# EAGLE schematic dac2_v2 (EAGLE 5.12)
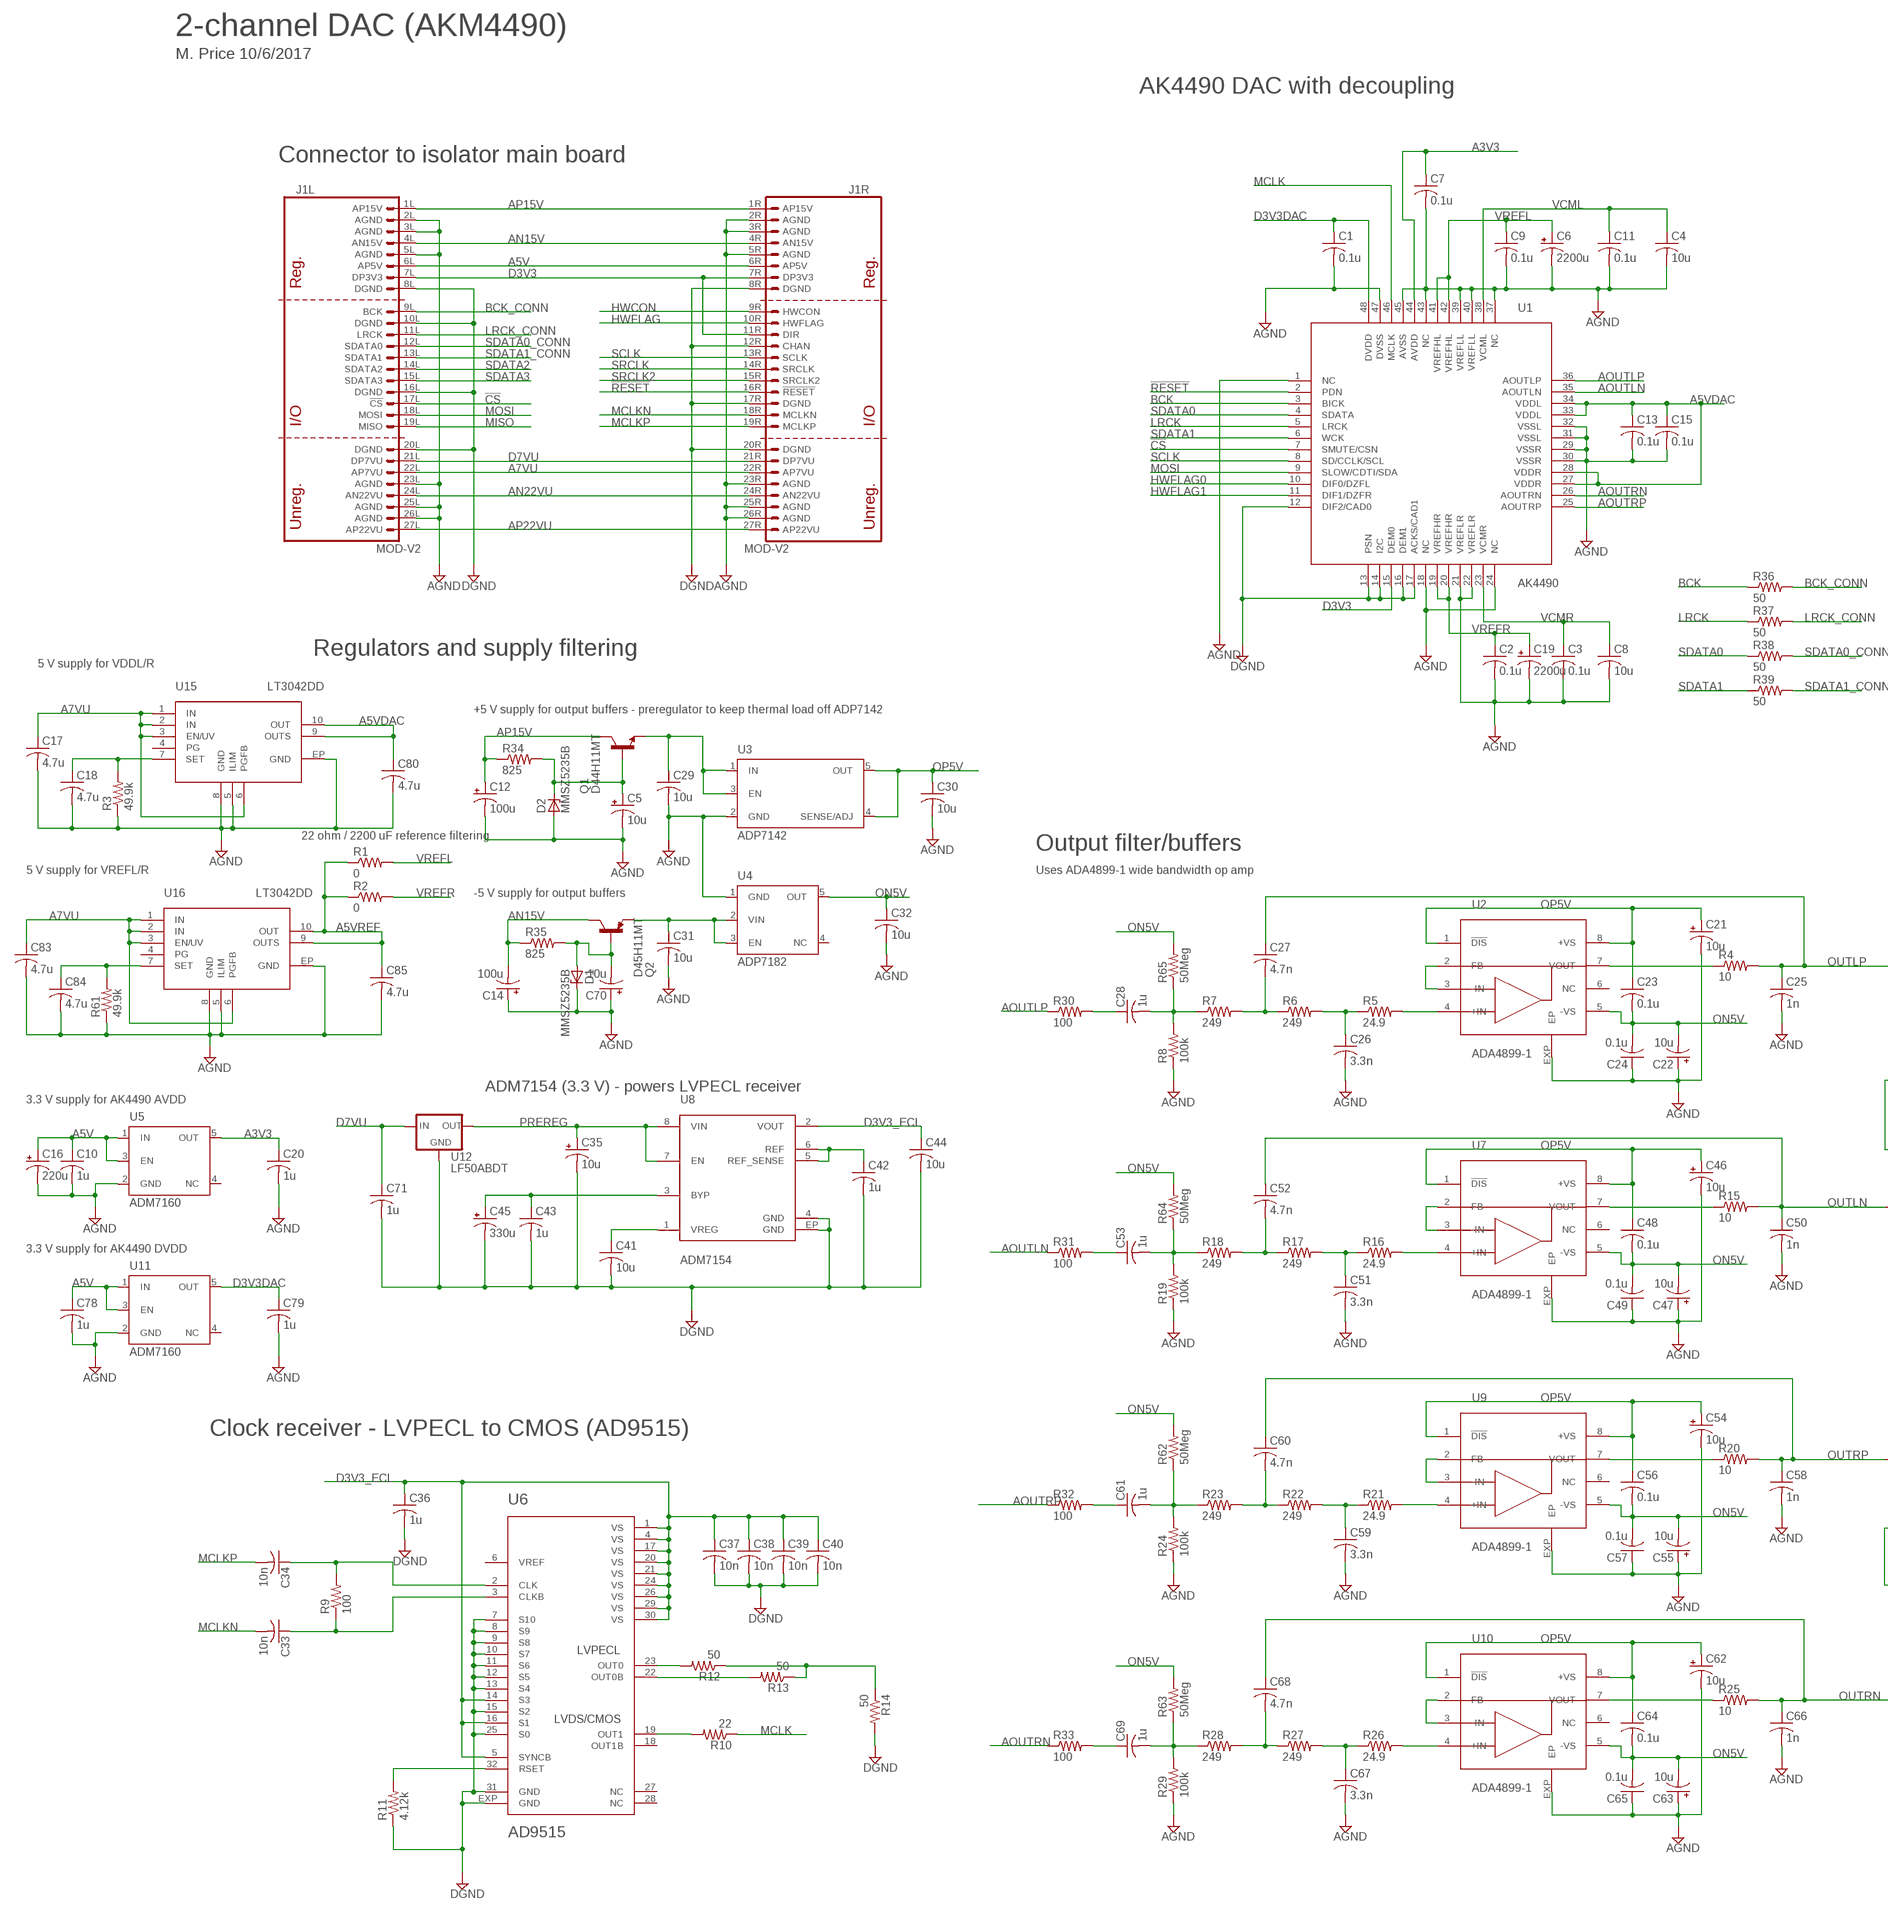
[diagram p0: schematic, sheet 1, part 1 of 2]
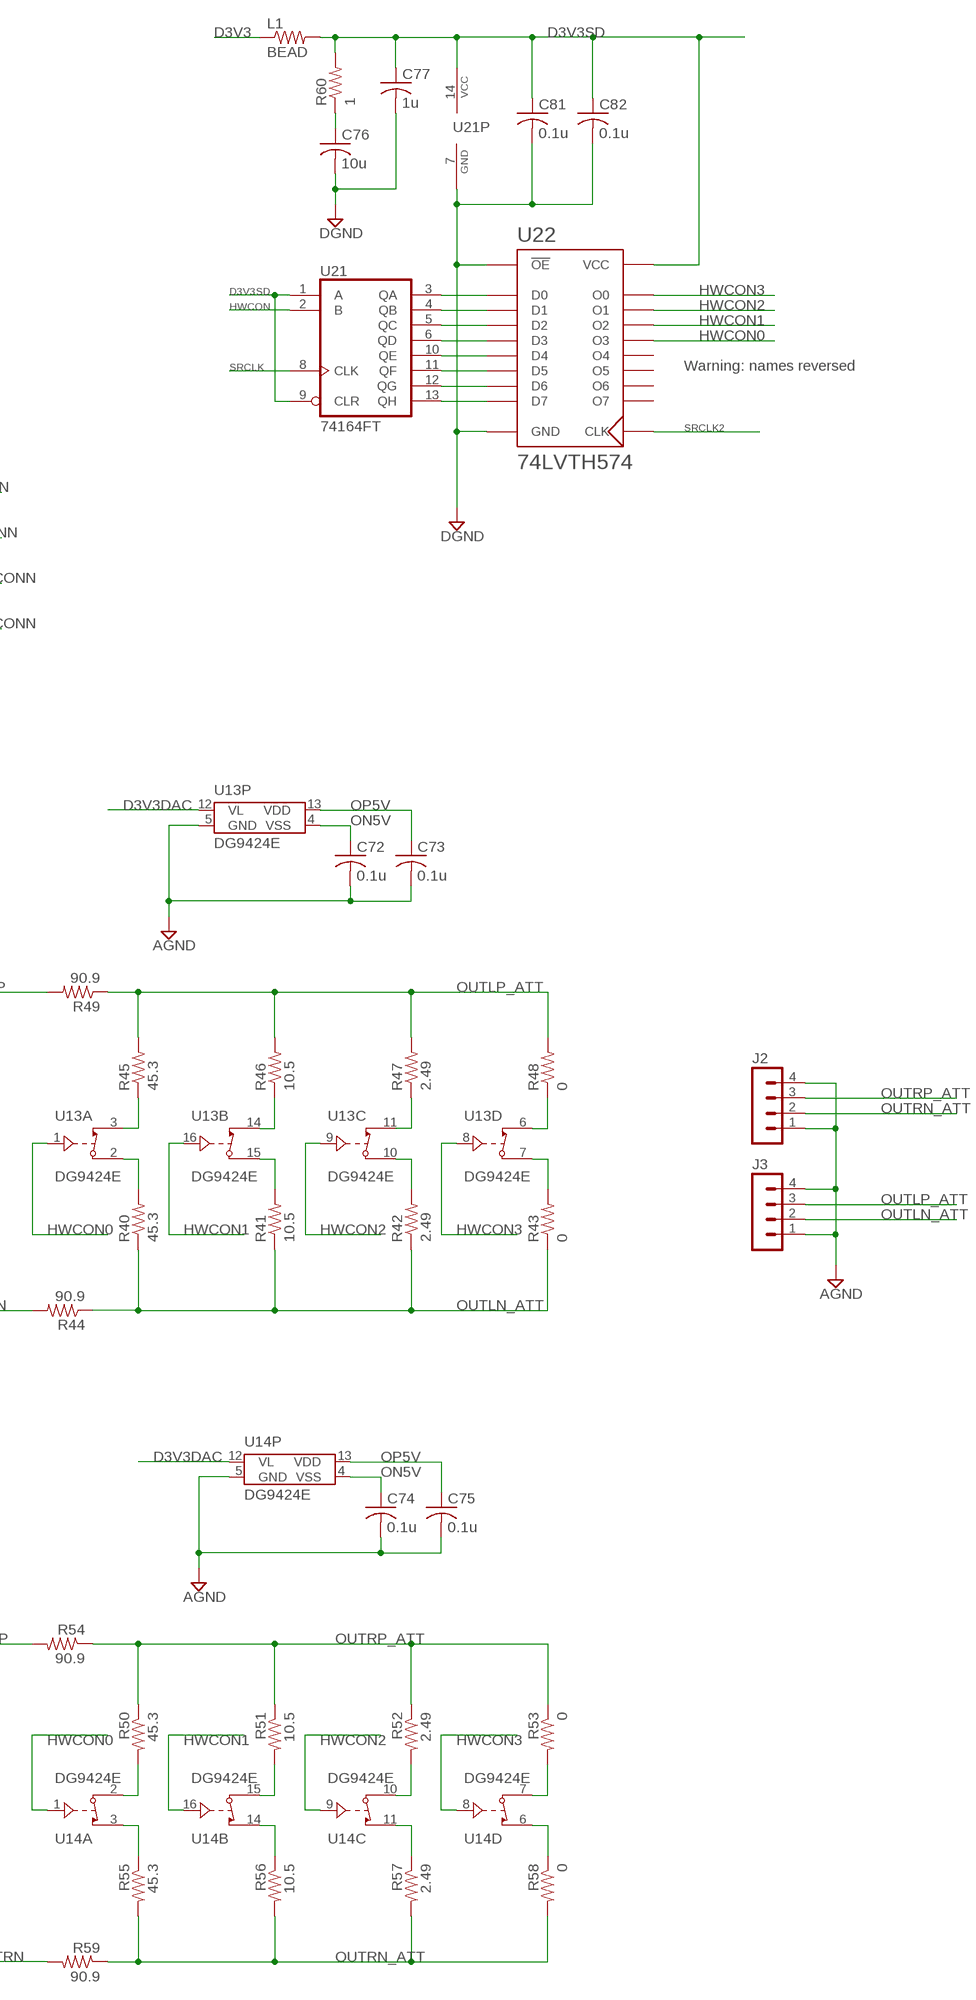
[diagram p1: schematic, sheet 1, part 2 of 2]

## Parts
C1  0.1u  C-USC0603  [C0603]
C2  0.1u  C-USC0603  [C0603]
C3  0.1u  C-USC0603  [C0603]
C4  10u  C-USC1206  [C1206]
C5  10u  CPOL-USB  [PANASONIC_B]
C6  2200u  CPOL-US  [PANASONIC_H13]
C7  0.1u  C-USC0603  [C0603]
C8  10u  C-USC1206  [C1206]
C9  0.1u  C-USC0603  [C0603]
C10  1u  C-USC0603  [C0603]
C11  0.1u  C-USC0603  [C0603]
C12  100u  CPOL-USE  [PANASONIC_E]
C13  0.1u  C-USC0603  [C0603]
C14  100u  CPOL-USE  [PANASONIC_E]
C15  0.1u  C-USC0603  [C0603]
C16  220u  CPOL-USE  [PANASONIC_E]
C17  4.7u  C-USC1206  [C1206]
C18  4.7u  C-USC1206  [C1206]
C19  2200u  CPOL-US  [PANASONIC_H13]
C20  1u  C-USC0603  [C0603]
C21  10u  CPOL-USB  [PANASONIC_B]
C22  10u  CPOL-USB  [PANASONIC_B]
C23  0.1u  C-USC0603  [C0603]
C24  0.1u  C-USC0603  [C0603]
C25  1n  C-USC0603  [C0603]
C26  3.3n  C-USC0603  [C0603]
C27  4.7n  C-USC0603  [C0603]
C28  1u  C-US050-050X075  [C050-050X075]
C29  10u  C-USC1206  [C1206]
C30  10u  C-USC1206  [C1206]
C31  10u  C-USC1206  [C1206]
C32  10u  C-USC1206  [C1206]
C33  10n  C-USC0603  [C0603]
C34  10n  C-USC0603  [C0603]
C35  10u  CPOL-USB  [PANASONIC_B]
C36  1u  C-USC0805  [C0805]
C37  10n  C-USC0402  [C0402]
C38  10n  C-USC0402  [C0402]
C39  10n  C-USC0402  [C0402]
C40  10n  C-USC0402  [C0402]
C41  10u  C-USC1206  [C1206]
C42  1u  C-USC0805  [C0805]
C43  1u  C-USC0805  [C0805]
C44  10u  C-USC1206  [C1206]
C45  330u  CPOL-USCT7343  [CT7343]
C46  10u  CPOL-USB  [PANASONIC_B]
C47  10u  CPOL-USB  [PANASONIC_B]
C48  0.1u  C-USC0603  [C0603]
C49  0.1u  C-USC0603  [C0603]
C50  1n  C-USC0603  [C0603]
C51  3.3n  C-USC0603  [C0603]
C52  4.7n  C-USC0603  [C0603]
C53  1u  C-US050-050X075  [C050-050X075]
C54  10u  CPOL-USB  [PANASONIC_B]
C55  10u  CPOL-USB  [PANASONIC_B]
C56  0.1u  C-USC0603  [C0603]
C57  0.1u  C-USC0603  [C0603]
C58  1n  C-USC0603  [C0603]
C59  3.3n  C-USC0603  [C0603]
C60  4.7n  C-USC0603  [C0603]
C61  1u  C-US050-050X075  [C050-050X075]
C62  10u  CPOL-USB  [PANASONIC_B]
C63  10u  CPOL-USB  [PANASONIC_B]
C64  0.1u  C-USC0603  [C0603]
C65  0.1u  C-USC0603  [C0603]
C66  1n  C-USC0603  [C0603]
C67  3.3n  C-USC0603  [C0603]
C68  4.7n  C-USC0603  [C0603]
C69  1u  C-US050-050X075  [C050-050X075]
C70  10u  CPOL-USB  [PANASONIC_B]
C71  1u  C-USC0805  [C0805]
C72  0.1u  C-USC0603  [C0603]
C73  0.1u  C-USC0603  [C0603]
C74  0.1u  C-USC0603  [C0603]
C75  0.1u  C-USC0603  [C0603]
C76  10u  C-USC1206  [C1206]
C77  1u  C-USC0603  [C0603]
C78  1u  C-USC0603  [C0603]
C79  1u  C-USC0603  [C0603]
C80  4.7u  C-USC1206  [C1206]
C81  0.1u  C-USC0603  [C0603]
C82  0.1u  C-USC0603  [C0603]
C83  4.7u  C-USC1206  [C1206]
C84  4.7u  C-USC1206  [C1206]
C85  4.7u  C-USC1206  [C1206]
D1  MMSZ5235B  ZD  [SOD123]
D2  MMSZ5235B  ZD  [SOD123]
J1  MOD-V2  [MOD-V2]
J2  MA04-1  [MA04-1]
J3  MA04-1  [MA04-1]
L1  BEAD  R-US_R1206  [R1206]
Q1  D44H11MT  [DPAK]
Q2  D45H11MT  [DPAK]
R1  0  R-US_R0603  [R0603]
R2  0  R-US_R0603  [R0603]
R3  49.9k  R-US_R0603  [R0603]
R4  10  R-US_R0603  [R0603]
R5  24.9  R-US_R0603  [R0603]
R6  249  R-US_R0603  [R0603]
R7  249  R-US_R0603  [R0603]
R8  100k  R-US_R0603  [R0603]
R9  100  R-US_R0603  [R0603]
R10  22  R-US_R0603  [R0603]
R11  4.12k  R-US_R0603  [R0603]
R12  50  R-US_R0603  [R0603]
R13  50  R-US_R0603  [R0603]
R14  50  R-US_R0603  [R0603]
R15  10  R-US_R0603  [R0603]
R16  24.9  R-US_R0603  [R0603]
R17  249  R-US_R0603  [R0603]
R18  249  R-US_R0603  [R0603]
R19  100k  R-US_R0603  [R0603]
R20  10  R-US_R0603  [R0603]
R21  24.9  R-US_R0603  [R0603]
R22  249  R-US_R0603  [R0603]
R23  249  R-US_R0603  [R0603]
R24  100k  R-US_R0603  [R0603]
R25  10  R-US_R0603  [R0603]
R26  24.9  R-US_R0603  [R0603]
R27  249  R-US_R0603  [R0603]
R28  249  R-US_R0603  [R0603]
R29  100k  R-US_R0603  [R0603]
R30  100  R-US_R0603  [R0603]
R31  100  R-US_R0603  [R0603]
R32  100  R-US_R0603  [R0603]
R33  100  R-US_R0603  [R0603]
R34  825  R-US_R0603  [R0603]
R35  825  R-US_R0603  [R0603]
R36  50  R-US_R0603  [R0603]
R37  50  R-US_R0603  [R0603]
R38  50  R-US_R0603  [R0603]
R39  50  R-US_R0603  [R0603]
R40  45.3  R-US_R0603  [R0603]
R41  10.5  R-US_R0603  [R0603]
R42  2.49  R-US_R0603  [R0603]
R43  0  R-US_R0603  [R0603]
R44  90.9  R-US_R0603  [R0603]
R45  45.3  R-US_R0603  [R0603]
R46  10.5  R-US_R0603  [R0603]
R47  2.49  R-US_R0603  [R0603]
R48  0  R-US_R0603  [R0603]
R49  90.9  R-US_R0603  [R0603]
R50  45.3  R-US_R0603  [R0603]
R51  10.5  R-US_R0603  [R0603]
R52  2.49  R-US_R0603  [R0603]
R53  0  R-US_R0603  [R0603]
R54  90.9  R-US_R0603  [R0603]
R55  45.3  R-US_R0603  [R0603]
R56  10.5  R-US_R0603  [R0603]
R57  2.49  R-US_R0603  [R0603]
R58  0  R-US_R0603  [R0603]
R59  90.9  R-US_R0603  [R0603]
R60  1  R-US_R0603  [R0603]
R61  49.9k  R-US_R0603  [R0603]
R62  50Meg  R-US_R0603  [R0603]
R63  50Meg  R-US_R0603  [R0603]
R64  50Meg  R-US_R0603  [R0603]
R65  50Meg  R-US_R0603  [R0603]
U1  AK4490  [P-QFP48-7X7MM]
U2  ADA4899-1  [LFCSP8]
U3  ADP7142  [SOT23-DBV]
U4  ADP7182  [SOT23-DBV]
U5  ADM7160  [SOT23-DBV]
U6  AD9515  [LFCSP32]
U7  ADA4899-1  [LFCSP8]
U8  ADM7154  [SO8-EP]
U9  ADA4899-1  [LFCSP8]
U10  ADA4899-1  [LFCSP8]
U11  ADM7160  [SOT23-DBV]
U12  LF50ABDT  78XXS  [DPACK]
U13  DG9424E  ADG412RU  [TSSOP16]
U14  DG9424E  ADG412RU  [TSSOP16]
U15  LT3042DD  [DFN10]
U16  LT3042DD  [DFN10]
U21  74164FT  [TSSOP14]
U22  74LVTH574  [TSSOP20]

## Nets
!CS: J1.17L(L:!CS) U1.7(SMUTE/CSN)
!RESET: J1.16R(R:!RESET) U1.2(PDN)
A3V3: C7.1 C20.1 U1.44(AVDD) U5.5(OUT)
A5V: C10.1 C16.+ C78.1 J1.6L(L:AP5V) J1.6R(R:AP5V) U5.1(IN) U5.3(EN) U11.1(IN) U11.3(EN)
A5VDAC: C13.1 C15.1 C80.1 U1.27(VDDR) U1.28(VDDR) U1.33(VDDL) U1.34(VDDL) U15.9(OUTS) U15.10(OUT)
A5VREF: C85.1 R1.1 R2.1 U16.9(OUTS) U16.10(OUT)
A7VU: C17.1 C83.1 J1.22L(L:AP7VU) J1.22R(R:AP7VU) U15.1(IN) U15.2(IN) U15.3(EN/UV) U15.6(PGFB) U16.1(IN) U16.2(IN) U16.3(EN/UV) U16.6(PGFB)
AGND: C1.2 C2.2 C3.2 C4.2 C5.- C6.- C7.2 C8.2 C9.2 C10.2 C11.2 C12.- C13.2 C14.+ C15.2 C16.- C17.2 C18.2 C19.- C20.2 C21.- C22.+ C24.1 C25.2 C26.2 C29.2 C30.2 C31.2 C32.2 C46.- C47.+ C49.1 C50.2 C51.2 C54.- C55.+ C57.1 C58.2 C59.2 C62.- C63.+ C65.1 C66.2 C67.2 C70.+ C72.2 C73.2 C74.2 C75.2 C78.2 C79.2 C80.2 C83.2 C84.2 C85.2 D1.C D2.A J1.2L(L:AGND) J1.2R(R:AGND) J1.3L(L:AGND) J1.3R(R:AGND) J1.5L(L:AGND) J1.5R(R:AGND) J1.23L(L:AGND) J1.23R(R:AGND) J1.25L(L:AGND) J1.25R(R:AGND) J1.26L(L:AGND) J1.26R(R:AGND) J2.1 J2.4 J3.1 J3.4 R3.1 R8.1 R19.1 R24.1 R29.1 R61.1 U1.1(NC) U1.18(NC) U1.21(VREFLR) U1.22(VREFLR) U1.24(NC) U1.29(VSSR) U1.30(VSSR) U1.31(VSSL) U1.32(VSSL) U1.37(NC) U1.39(VREFLL) U1.40(VREFLL) U1.43(NC) U1.45(AVSS) U1.47(DVSS) U2.EXP(EP) U3.2(GND) U4.1(GND) U5.2(GND) U7.EXP(EP) U9.EXP(EP) U10.EXP(EP) U11.2(GND) U13.5(P:GND) U14.5(P:GND) U15.5(ILIM) U15.8(GND) U15.EP(GND) U16.5(ILIM) U16.8(GND) U16.EP(GND)
AN15V: C14.- J1.4L(L:AN15V) J1.4R(R:AN15V) Q2.2(C) R35.1
AN22VU: J1.24L(L:AN22VU) J1.24R(R:AN22VU)
AOUTLN: R31.1 U1.35(AOUTLN)
AOUTLP: R30.1 U1.36(AOUTLP)
AOUTRN: R33.1 U1.26(AOUTRN)
AOUTRP: R32.1 U1.25(AOUTRP)
AP15V: C12.+ J1.1L(L:AP15V) J1.1R(R:AP15V) Q1.2(C) R34.1
AP22VU: J1.27L(L:AP22VU) J1.27R(R:AP22VU)
BCK: R36.1 U1.3(BICK)
BCK_CONN: J1.9L(L:BCK) R36.2
D3V3: J1.7L(L:DP3V3) J1.7R(R:DP3V3) J1.11R(R:DIR) L1.1 U1.15(DEM0)
D3V3_ECL: C36.1 C37.1 C38.1 C39.1 C40.1 C44.1 U6.1(VS) U6.4(VS) U6.5(SYNCB) U6.14(S3) U6.16(S1) U6.17(VS) U6.20(VS) U6.21(VS) U6.24(VS) U6.26(VS) U6.29(VS) U6.30(VS) U8.2(VOUT)
D3V3DAC: C1.1 C79.1 U1.48(DVDD) U11.5(OUT) U13.12(P:VL) U14.12(P:VL)
D3V3SD [power]: C77.1 C81.1 C82.1 L1.2 R60.2 U21.1(A) U21.9(CLR) U21.14(VCC) U22.20(VCC)
D7VU: C71.1 J1.21L(L:DP7VU) J1.21R(R:DP7VU) U12.1(IN)
DGND: C35.- C36.2 C37.2 C38.2 C39.2 C40.2 C41.2 C42.2 C43.2 C44.2 C45.- C71.2 C76.2 C77.2 C81.2 C82.2 J1.8L(L:DGND) J1.8R(R:DGND) J1.10L(L:DGND) J1.12R(R:CHAN) J1.16L(L:DGND) J1.17R(R:DGND) J1.20L(L:DGND) J1.20R(R:DGND) R11.1 R14.2 U1.12(DIF2/CAD0) U1.13(PSN) U1.14(I2C) U1.16(DEM1) U1.17(ACKS/CAD1) U6.7(S10) U6.8(S9) U6.9(S8) U6.10(S7) U6.11(S6) U6.12(S5) U6.13(S4) U6.15(S2) U6.25(S0) U6.31(GND) U6.EXP(GND) U8.4(GND) U8.EP(GND) U12.4(GND) U21.7(GND) U22.1(!OE) U22.10(GND)
HWCON: J1.9R(R:HWCON) U21.2(B)
HWCON0: U13.1(A:IN) U14.1(A:IN) U22.16(O3)
HWCON1: U13.16(B:IN) U14.16(B:IN) U22.17(O2)
HWCON2: U13.9(C:IN) U14.9(C:IN) U22.18(O1)
HWCON3: U13.8(D:IN) U14.8(D:IN) U22.19(O0)
HWFLAG: J1.10R(R:HWFLAG)
HWFLAG0: U1.10(DIF0/DZFL)
HWFLAG1: U1.11(DIF1/DZFR)
LRCK: R37.1 U1.5(LRCK)
LRCK_CONN: J1.11L(L:LRCK) R37.2
MCLK: R10.1 U1.46(MCLK)
MCLKN: C33.2 J1.18R(R:MCLKN)
MCLKP: C34.2 J1.19R(R:MCLKP)
MISO: J1.19L(L:MISO)
MOSI: J1.18L(L:MOSI) U1.9(SLOW/CDTI/SDA)
N$1: U2.2(FB) U2.3(-IN)
N$2: C28.2 R7.1 R8.2 R65.1
N$3: C27.2 R6.1 R7.2
N$4: C26.1 R5.1 R6.2
N$5: R5.2 U2.4(+IN)
N$6: R15.1 U7.7(VOUT)
N$7: R4.1 U2.7(VOUT)
N$8: C28.1 R30.2
N$9: C69.1 R33.2
N$11: R12.2 U6.23(OUT0)
N$12: U7.2(FB) U7.3(-IN)
N$13: C53.2 R18.1 R19.2 R64.1
N$14: C34.1 R9.2 U6.2(CLK)
N$15: C33.1 R9.1 U6.3(CLKB)
N$16: C52.2 R17.1 R18.2
N$17: C51.1 R16.1 R17.2
N$18: R16.2 U7.4(+IN)
N$19: C41.1 U8.1(VREG)
N$20: C61.1 R32.2
N$21: C53.1 R31.2
N$22: R10.2 U6.19(OUT1)
N$23: R20.1 U9.7(VOUT)
N$24: C70.- D1.A Q2.1(B) R35.2
N$25: R13.2 U6.22(OUT0B)
N$26: C43.1 C45.+ U8.3(BYP)
N$27: R11.2 U6.32(RSET)
N$28: C42.1 U8.5(REF_SENSE) U8.6(REF)
N$29: R12.1 R13.1 R14.1
N$30: U9.2(FB) U9.3(-IN)
N$31: C61.2 R23.1 R24.2 R62.1
N$32: C60.2 R22.1 R23.2
N$33: C59.1 R21.1 R22.2
N$34: R21.2 U9.4(+IN)
N$35: C31.1 Q2.3(E) U4.2(VIN) U4.3(EN)
N$36: R25.1 U10.7(VOUT)
N$37: C5.+ D2.C Q1.1(B) R34.2
N$38: U10.2(FB) U10.3(-IN)
N$39: C69.2 R28.1 R29.2 R63.1
N$40: C68.2 R27.1 R28.2
N$41: C67.1 R26.1 R27.2
N$42: R26.2 U10.4(+IN)
N$44: C29.1 Q1.3(E) U3.1(IN) U3.3(EN)
N$47: R45.1 U13.3(A:S)
N$48: R40.2 U13.2(A:D)
N$49: R55.1 U14.3(A:S)
N$50: R47.1 U13.11(C:S)
N$51: R42.2 U13.10(C:D)
N$52: R41.2 U13.15(B:D)
N$53: R43.2 U13.7(D:D)
N$54: R48.1 U13.6(D:S)
N$55: R46.1 U13.14(B:S)
N$56: U21.3(QA) U22.2(D0)
N$57: U21.4(QB) U22.3(D1)
N$58: U21.5(QC) U22.4(D2)
N$59: U21.6(QD) U22.5(D3)
N$60: U21.10(QE) U22.6(D4)
N$61: U21.11(QF) U22.7(D5)
N$62: U21.12(QG) U22.8(D6)
N$63: U21.13(QH) U22.9(D7)
N$64: C76.1 R60.1
N$65: R56.1 U14.14(B:S)
N$66: R57.1 U14.11(C:S)
N$67: R58.1 U14.6(D:S)
N$68: R53.2 U14.7(D:D)
N$69: R52.2 U14.10(C:D)
N$70: R51.2 U14.15(B:D)
N$71: R50.2 U14.2(A:D)
N$72: C18.1 R3.2 U15.7(SET)
N$73: C84.1 R61.2 U16.7(SET)
ON5V: C22.- C23.2 C24.2 C32.1 C47.- C48.2 C49.2 C55.- C56.2 C57.2 C63.- C64.2 C65.2 C72.1 C74.1 R62.2 R63.2 R64.2 R65.2 U2.5(-VS) U4.5(OUT) U7.5(-VS) U9.5(-VS) U10.5(-VS) U13.4(P:VSS) U14.4(P:VSS)
OP5V: C21.+ C23.1 C30.1 C46.+ C48.1 C54.+ C56.1 C62.+ C64.1 C73.1 C75.1 U2.1(!DIS) U2.8(+VS) U3.4(SENSE/ADJ) U3.5(OUT) U7.1(!DIS) U7.8(+VS) U9.1(!DIS) U9.8(+VS) U10.1(!DIS) U10.8(+VS) U13.13(P:VDD) U14.13(P:VDD)
OUTLN: C50.1 C52.1 R15.2 R44.2
OUTLN_ATT: J3.2 R40.1 R41.1 R42.1 R43.1 R44.1
OUTLP: C25.1 C27.1 R4.2 R49.2
OUTLP_ATT: J3.3 R45.2 R46.2 R47.2 R48.2 R49.1
OUTRN: C66.1 C68.1 R25.2 R59.2
OUTRN_ATT: J2.2 R55.2 R56.2 R57.2 R58.2 R59.1
OUTRP: C58.1 C60.1 R20.2 R54.2
OUTRP_ATT: J2.3 R50.1 R51.1 R52.1 R53.1 R54.1
PREREG: C35.+ U8.7(EN) U8.8(VIN) U12.3(OUT)
SCLK: J1.13R(R:SCLK) U1.8(SD/CCLK/SCL)
SDATA0: R38.1 U1.4(SDATA)
SDATA0_CONN: J1.12L(L:SDATA0) R38.2
SDATA1: R39.1 U1.6(WCK)
SDATA1_CONN: J1.13L(L:SDATA1) R39.2
SDATA2: J1.14L(L:SDATA2)
SDATA3: J1.15L(L:SDATA3)
SRCLK: J1.14R(R:SRCLK) U21.8(CLK)
SRCLK2: J1.15R(R:SRCLK2) U22.11(CLK)
VCML: C4.1 C11.1 U1.38(VCML)
VCMR: C3.1 C8.1 U1.23(VCMR)
VREFL: C6.+ C9.1 R1.2 U1.41(VREFHL) U1.42(VREFHL)
VREFR: C2.1 C19.+ R2.2 U1.19(VREFHR) U1.20(VREFHR)
Unconnected: U2.6(NC) U4.4(NC) U5.4(NC) U6.6(VREF) U6.18(OUT1B) U6.27(NC) U6.28(NC) U7.6(NC) U9.6(NC) U10.6(NC) U11.4(NC) U15.4(PG) U16.4(PG) U22.12(O7) U22.13(O6) U22.14(O5) U22.15(O4)

## Notes on the sheet
- 2-channel DAC (AKM4490)
- M. Price 10/6/2017
- AK4490 DAC with decoupling
- Connector to isolator main board
- Warning: names reversed
- Regulators and supply filtering
- 5 V supply for VDDL/R
- +5 V supply for output buffers - preregulator to keep thermal load off ADP7142
- 22 ohm / 2200 uF reference filtering
- Output filter/buffers
- 5 V supply for VREFL/R | Uses ADA4899-1 wide bandwidth op amp
- -5 V supply for output buffers
- ADM7154 (3.3 V) - powers LVPECL receiver
- 3.3 V supply for AK4490 AVDD
- 3.3 V supply for AK4490 DVDD
- Clock receiver - LVPECL to CMOS (AD9515)

## Library data of the parts
C1-C4 C7-C11 C13 C15 C17 C18 C20 C23-C34 C36-C44 C48-C53 C56-C61 C64-C69 C71-C85 = rcl:C-US: CAPACITOR, American symbol
C5 C12 C14 C16 C21 C22 C35 C45-C47 C54 C55 C62 C63 C70 = rcl:CPOL-US: POLARIZED CAPACITOR, American symbol
C6 C19 = cdp:CPOL-US
D1 D2 = cdp:ZD
J1 = cdp:MOD-V2
J2 J3 = con-lstb:MA04-1: PIN HEADER; OC_FARNELL: unknown; OC_NEWARK: unknown
L1 R1-R65 = rcl:R-US_: RESISTOR, American symbol
Q1 = cdp:D44H11
Q2 = cdp:D45H11
U1 = cdp:AK4490
U2 U7 U9 U10 = cdp:ADA4899-1
U3 = cdp:ADP7142
U4 = cdp:ADP7182
U5 U11 = cdp:ADM7160
U6 = cdp:AD9515
U8 = cdp:ADM7154
U12 = cdp:78XXS: VOLTAGE REGULATOR
U13 U14 = analog-devices:ADG412: LC2MOS Precision Quad SPST Switches Source: http://www.analog.com/static/imported-files/data_sheets/ADG411_412_413.pdf; MF: ALTERA CORPORATION; MPN: ADG412BRU-REEL7; OC_FARNELL: unknown; OC_NEWARK: 59K1251
U15 U16 = cdp:LT3042
U21 = cdp:74*164: 8-bit parallel out SHIFT REGISTER
U22 = cdp:74LVTH574